# Altium schematic sheet TPA3116D2.SchDoc
size A4; SheetNumber: 2; SheetTotal: 4
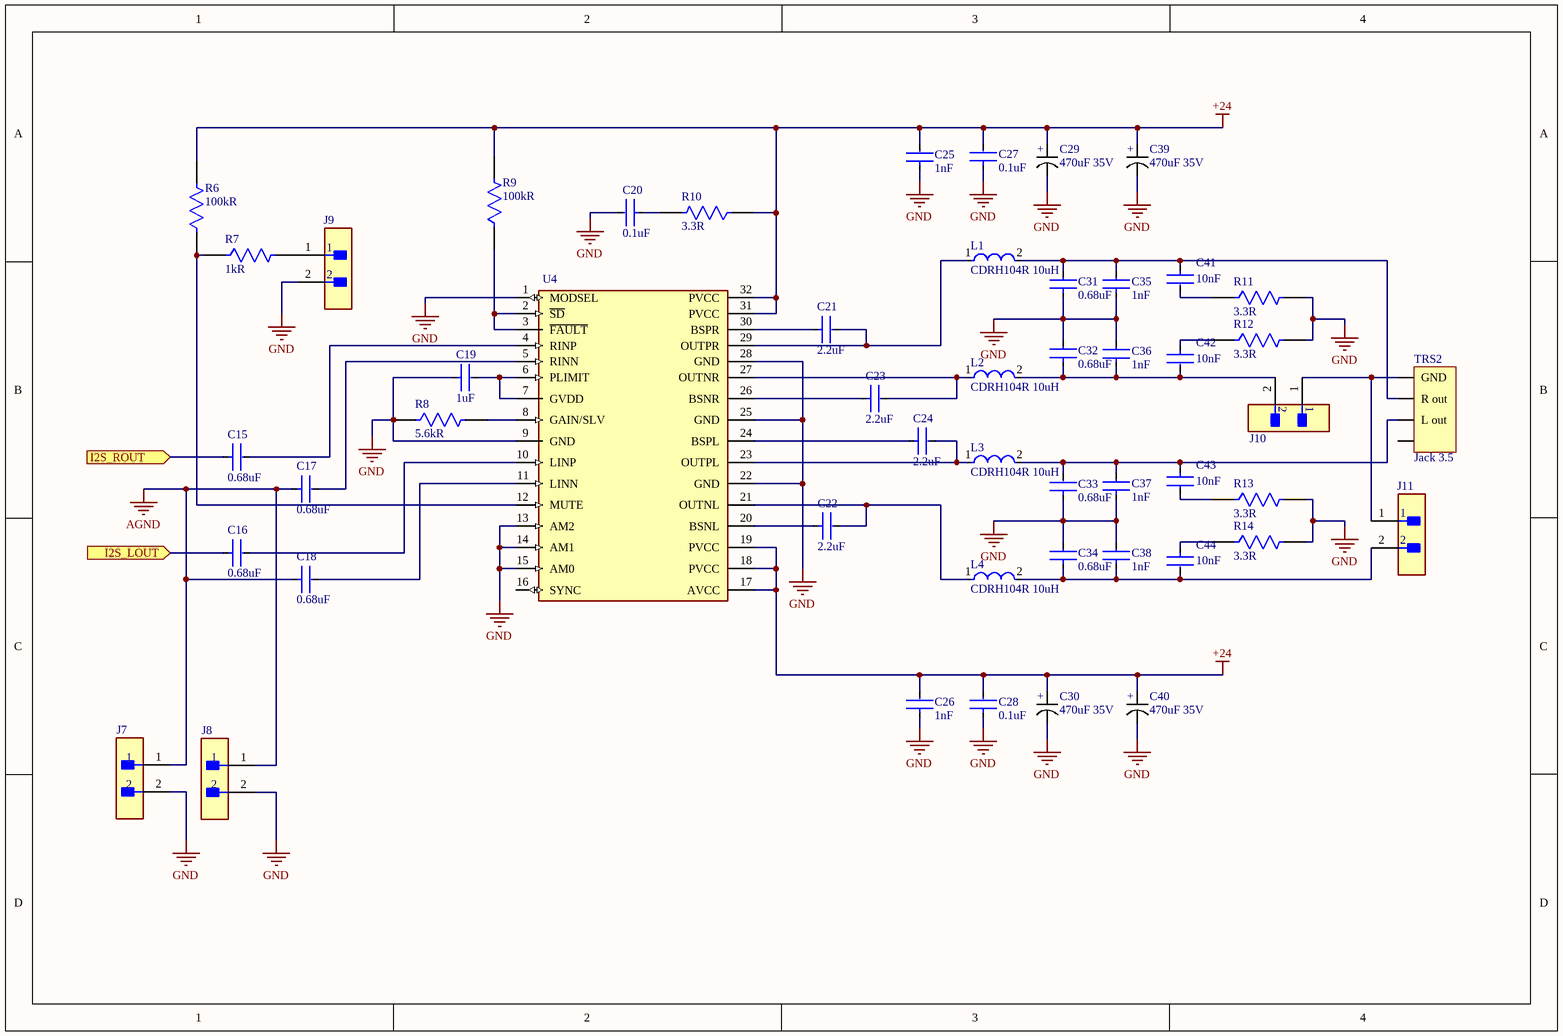
[diagram p0: TPA3116D2.SchDoc]

## Parts
C15  0.68uF  [FP-CL21-IPC_C]
C16  0.68uF  [FP-CL21-IPC_C]
C17  0.68uF  [FP-CL21-IPC_C]
C18  0.68uF  [FP-CL21-IPC_C]
C19  1uF  [FP-CL21-IPC_C]
C20  0.1uF  [FP-CL21-IPC_C]
C21  2.2uF  [FP-CL21-IPC_C]
C22  2.2uF  [FP-CL21-IPC_C]
C23  2.2uF  [FP-CL21-IPC_C]
C24  2.2uF  [FP-CL21-IPC_C]
C25  1nF  [FP-CL21-IPC_C]
C26  1nF  [FP-CL21-IPC_C]
C27  0.1uF  [FP-CL21-IPC_C]
C28  0.1uF  [FP-CL21-IPC_C]
C29  470uF 35V  [CAP VT 470uF 35V]
C30  470uF 35V  [CAP VT 470uF 35V]
C31  0.68uF  [FP-CL21-IPC_C]
C32  0.68uF  [FP-CL21-IPC_C]
C33  0.68uF  [FP-CL21-IPC_C]
C34  0.68uF  [FP-CL21-IPC_C]
C35  1nF  [FP-CL21-IPC_C]
C36  1nF  [FP-CL21-IPC_C]
C37  1nF  [FP-CL21-IPC_C]
C38  1nF  [FP-CL21-IPC_C]
C39  470uF 35V  [CAP VT 470uF 35V]
C40  470uF 35V  [CAP VT 470uF 35V]
C41  10nF  [FP-CL21-IPC_C]
C42  10nF  [FP-CL21-IPC_C]
C43  10nF  [FP-CL21-IPC_C]
C44  10nF  [FP-CL21-IPC_C]
J7  M22-2510205  [FP-M22-2510205-MFG]  (value not drawn)
J8  M22-2510205  [FP-M22-2510205-MFG]  (value not drawn)
J9  M22-2510205  [FP-M22-2510205-MFG]  (value not drawn)
J10  M22-2510205  [FP-M22-2510205-MFG]  (value not drawn)
J11  M22-2510205  [FP-M22-2510205-MFG]  (value not drawn)
L1  CDRH104R 10uH  [FP-CDRH104R-MFG]
L2  CDRH104R 10uH  [FP-CDRH104R-MFG]
L3  CDRH104R 10uH  [FP-CDRH104R-MFG]
L4  CDRH104R 10uH  [FP-CDRH104R-MFG]
R6  100kR  [FP-RP732A-IPC_C]
R7  1kR  [FP-RP732A-IPC_C]
R8  5.6kR  [FP-RP732A-IPC_C]
R9  100kR  [FP-RP732A-IPC_C]
R10  3.3R  [FP-RP732A-IPC_C]
R11  3.3R  [FP-RP732A-IPC_C]
R12  3.3R  [FP-RP732A-IPC_C]
R13  3.3R  [FP-RP732A-IPC_C]
R14  3.3R  [FP-RP732A-IPC_C]
TRS2  Jack 3.5  [PJ-327A]
U4  TPA3116D2QDADRQ1  [FP-DAD0032C-MFG]  (value not drawn)

## Ports
I2S_LOUT (in, see PCM5102[3C]), I2S_ROUT (in, see PCM5102[3C])

## Nets
+24: C25.2 C26.2 C27.2 C28.2 C29.1(+) C30.1(+) C39.1(+) C40.1(+) R6.2 R9.2 R10.1 U4.17(AVCC) U4.18(PVCC) U4.19(PVCC) U4.31(PVCC) U4.32(PVCC)
AGND: C17.1 C18.1 J7.1 J8.1
GND: C19.1 C20.2 C25.1 C26.1 C27.1 C28.1 C29.2(-) C30.2(-) C31.1 C32.2 C33.1 C34.2 C35.1 C36.2 C37.1 C38.2 C39.2(-) C40.2(-) J7.2 J8.2 J9.2 R8.1 R11.2 R12.2 R13.2 R14.2 U4.1(MODSEL) U4.9(GND) U4.13(AM2) U4.14(AM1) U4.15(AM0) U4.22(GND) U4.25(GND) U4.28(GND)
I2S_LOUT: C16.1 ; port I2S_LOUT
I2S_ROUT: C15.1 ; port I2S_ROUT
NetC15_2: C15.2 U4.4(RINP)
NetC16_2: C16.2 U4.10(LINP)
NetC17_2: C17.2 U4.5(RINN)
NetC18_2: C18.2 U4.11(LINN)
NetC19_2: C19.2 U4.6(PLIMIT) U4.7(GVDD)
NetC20_1: C20.1 R10.2
NetC21_1: C21.1 U4.30(BSPR)
NetC21_2: C21.2 L1.1 U4.29(OUTPR)
NetC22_1: C22.1 U4.20(BSNL)
NetC22_2: C22.2 L4.1 U4.21(OUTNL)
NetC23_1: C23.1 U4.26(BSNR)
NetC23_2: C23.2 L2.1 U4.27(OUTNR)
NetC24_1: C24.1 U4.24(BSPL)
NetC24_2: C24.2 L3.1 U4.23(OUTPL)
NetC31_2: C31.2 C35.2 C41.1 L1.2 TRS2.2(R_out)
NetC32_1: C32.1 C36.1 C42.2 J10.2 L2.2
NetC33_2: C33.2 C37.2 C43.1 L3.2 TRS2.3(L_out)
NetC34_1: C34.1 C38.1 C44.2 J11.2 L4.2
NetC41_2: C41.2 R11.1
NetC42_1: C42.1 R12.1
NetC43_2: C43.2 R13.1
NetC44_1: C44.1 R14.1
NetJ9_1: J9.1 R7.2
NetJ10_1: J10.1 J11.1 TRS2.1(GND)
NetR6_1: R6.1 R7.1 U4.12(MUTE)
NetR8_2: R8.2 U4.8(GAIN/SLV)
NetR9_1: R9.1 U4.2(~{SD}) U4.3(~{FAULT})

Not connected (* = marked no-connect by the designer): TRS2 4; U4 16(SYNC)

## Library data of the parts
C15-C28 C31-C38 C41-C44 = CMP-13271-002689-1: CL21 Series 0805 47nF 50V ±5% Tolerance X7R Multilayer Ceramic Chip Capacitor; Voltage Rating (DC): 50V; Package Quantity: 10000; Height: 0.85mm; Max Operating Temperature: 125°C; Dielectric: X7R; Radiation Hardening: No; Mount: Surface Mount; Voltage Rating: 50V; Tolerance: 5%; Depth: 1.25mm; Min Operating Temperature: -55°C; Width: 0.049inch; Case/Package: 0805; Length: 2mm; Packaging: Tape and Reel; Thickness: 0.037inch
  C15-C18 C31-C34: Capacitance: 0.68uF
  C19: Capacitance: 1uF
  C20 C27 C28: Capacitance: 0.1uF
  C21-C24: Capacitance: 2.2uF
  C25 C26 C35-C38: Capacitance: 1nF
  C41-C44: Capacitance: 10nF
C29 C30 C39 C40 = Cap: VT 470uF 35V: Capacitance: 470uF; Voltage Rating (DC): 35V
J7-J11 = CMP-15831-000005-1: CONN HEADER VERT 2POS 2MM; Manufacturer: Harwin; Conn Gender: Male; Current Rating: 2A; Number Of Contacts: 2; Conn Orientation: Vertical; Temperature Range Low: -40°C; Device Class L1: Connectors; ComponentLink2URL: https://cdn.harwin.com/pdfs/C018XX_M22_Series_Connectors.pdf; Temperature Range High: +105°C; Pitch: 2mm; Number Of Rows: 1; Temperature: -40°C to +105°C; Automotive: No; Device Class L3: unset; Octopart: https://octopart.com/m22-2510205-harwin-2538221; Mouser Description: Headers & Wire Housings 2 PIN SIL VERTICAL GOLD PIN HEADER; Height: 5.45mm; Category: Conn; Digikey Description: CONN HEADER VERT 2POS 2MM; Contact Material: Gold,Nickel; Lead Free: Yes; ComponentLink2Description: Datasheet; Manufacturer Part Number: M22-2510205; Device Class L2: Headers and Wire Housings; Package: 0; Footprint Url: https://cdn.harwin.com/pdfs/M22-251.pdf; RoHS: TRUE
L1-L4 = CMP-48855-000006-1: FIXED IND 5.2UH 6A 22 MOHM SMD; Core Material: Ferrite; Max DC Current: 5.4A; Rated Current-Max: 5.5A; Test Frequency: 100kHz; Saturation Current: 5.6A; Tolerance: 30%; DC Resistance (DCR): 22mR; Shielding: Shielded; Depth: 10.3mm; Lead Free: Lead Free; Series: CDRH; Min Operating Temperature: -40°C; Mount: Surface Mount; Max Operating Temperature: 100°C; Termination: SMD/SMT; Width: 0.394inch; Radiation Hardening: No; Package Quantity: 1; Height: 4mm; Height - Seated (Max): 0.157inch; Military Standard: Not; Inductance: 10uH; Length: 10.5mm; Packaging: Tape and Reel; DC Current: 5.4A; Case/Package: Nonstandard; Current Rating: 5.4A
R6-R14 = CMP-03211-008429-2: Surface Mount Resistors, Precision Resistor, 2 Terminations, Size Code 0805, Cut Tape Length, .1%, Thin Film, 10K 0.1% 10PPM; Temperature Coefficient: 15ppm/°C; Number of Resistors: 1; Power Rating: 125mW; Voltage Rating (DC): 150V; REACH SVHC: No SVHC; Height: 0.55mm; Number of Pins: 2; ELV: Compliant; Termination: Solder; Number of Terminations: 2; Case Code (Imperial): 0805; Mount: Surface Mount; Case/Package: 0805; Case Code (Metric): 2012; Length: 2mm; Packaging: Cut Tape; Composition: Thin Film; Max Operating Temperature: 155°C; Tolerance: 0.1%; Min Operating Temperature: -55°C; Package Quantity: 250; Width: 1.25mm; Voltage Rating: 150V; Weight: 0.000194oz
  R6 R9: Resistance: 100kR
  R7: Resistance: 1kR
  R8: Resistance: 5.6kR
  R10-R14: Resistance: 3.3R
TRS2 = PJ327A
U4 = CMP-04894-000022-1: IC AMP CLASS D STER 50W 32HTSSOP; Min Supply Voltage: 4.5V; Max Supply Voltage: 26V; Voltage Gain: 36dB; Lead Free: Lead Free; Number of Pins: 32; Max Output Power: 50W; Mount: Surface Mount; Max Operating Temperature: 125°C; RoHS Compliant: Yes; Min Operating Temperature: -40°C; Case/Package: TSSOP; Packaging: Tape and Reel